# EAGLE design shirasu_v3 (EAGLE 9.6.2)
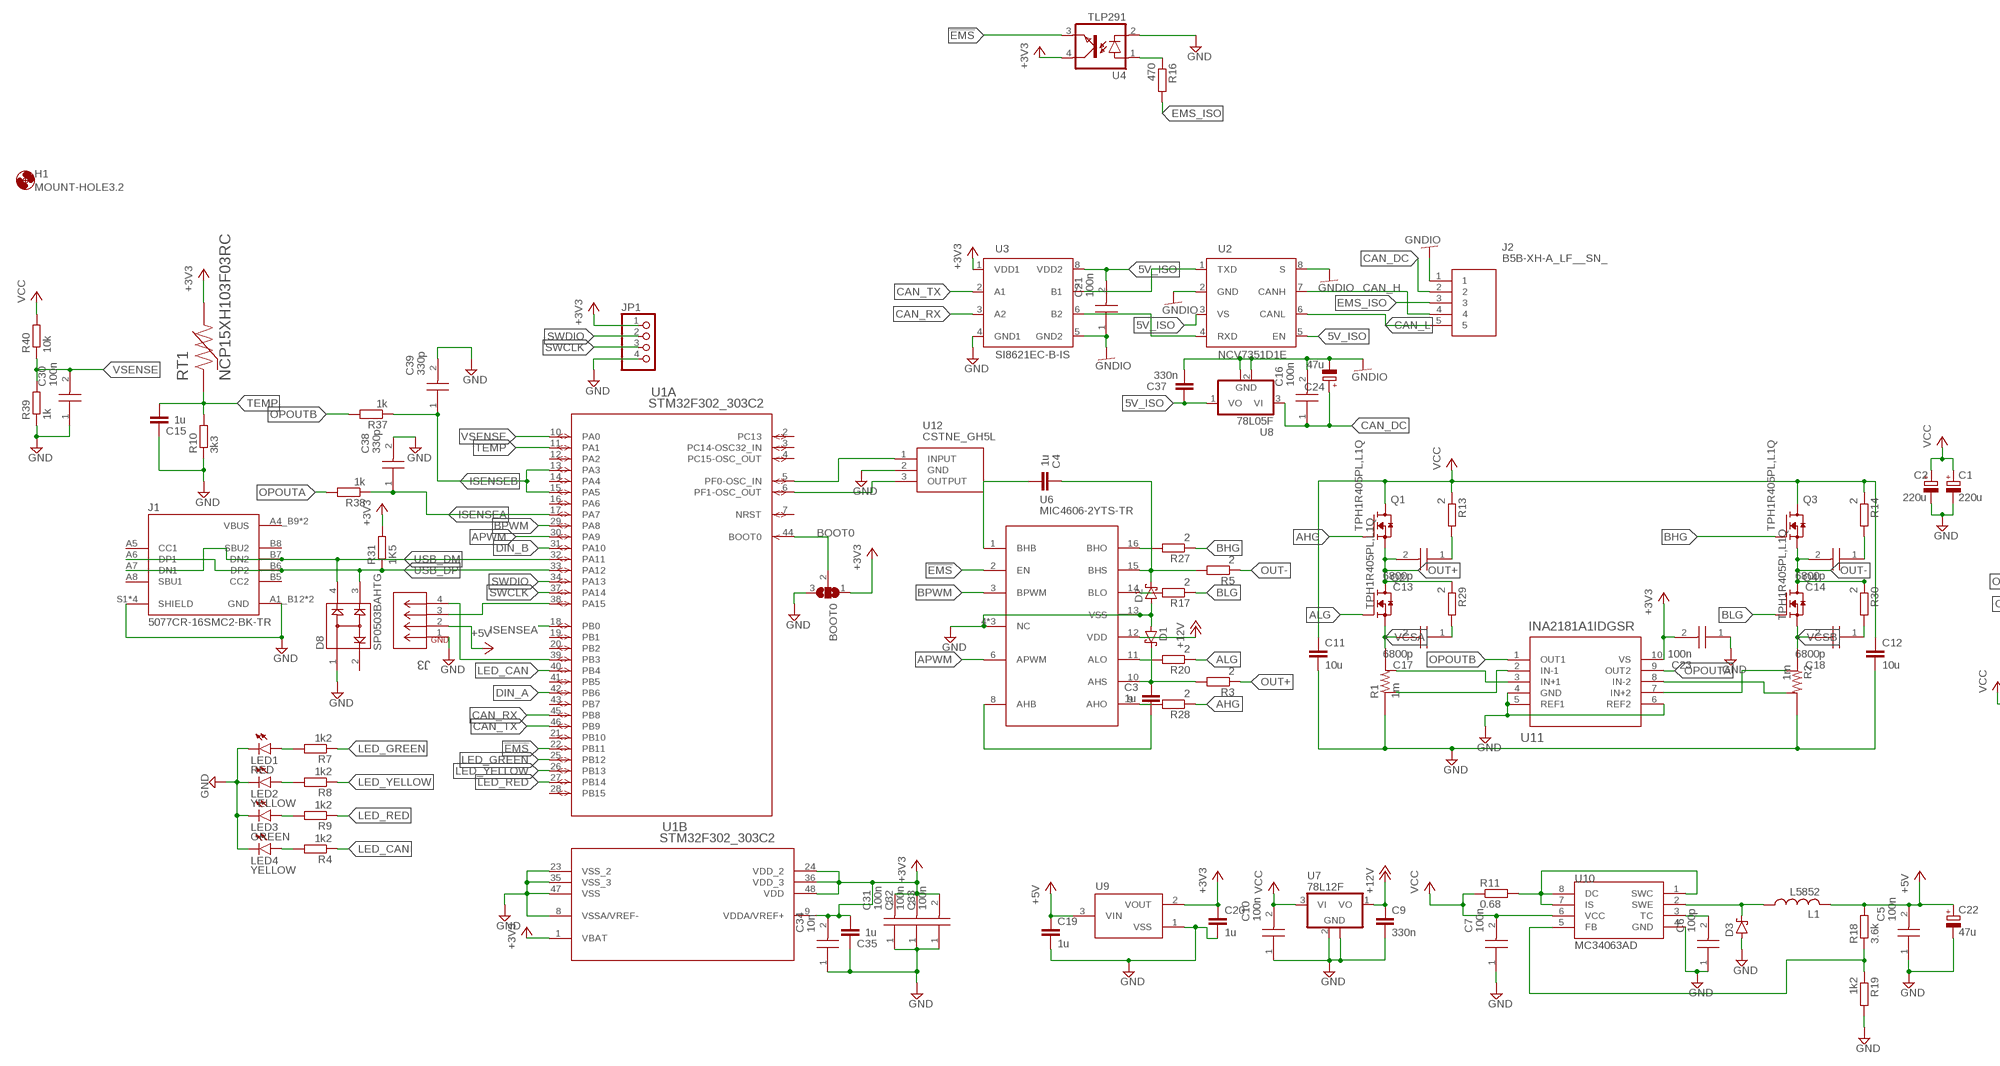
[diagram p0: schematic, sheet 1, part 1 of 2]
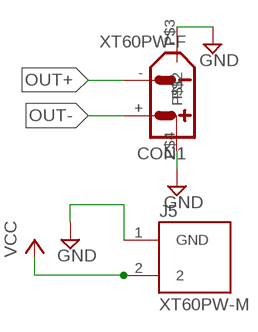
[diagram p1: schematic, sheet 1, part 2 of 2]

## Parts
BOOT0  SJ2W  [SJ_2]
C1  220u  CPOL-EUE5-10.5  [E5-10,5]
C2  220u  CPOL-EUE5-10.5  [E5-10,5]
C3  1u  C-EUC0603  [C0603]
C4  1u  C-EUC0603  [C0603]
C5  100n  0402B102K500NT  [CAPC1005X55N]
C6  100p  0402B102K500NT  [CAPC1005X55N]
C7  100n  0402B102K500NT  [CAPC1005X55N]
C9  330n  C-EUC0603  [C0603]
C10  100n  0402B102K500NT  [CAPC1005X55N]
C11  10u  C-EUC0805  [C0805]
C12  10u  C-EUC0805  [C0805]
C13  6800p  0402B102K500NT  [CAPC1005X55N]
C14  6800p  0402B102K500NT  [CAPC1005X55N]
C15  1u  C-EUC0603  [C0603]
C16  100n  0402B102K500NT  [CAPC1005X55N]
C17  6800p  0402B102K500NT  [CAPC1005X55N]
C18  6800p  0402B102K500NT  [CAPC1005X55N]
C19  1u  C-EUC0603  [C0603]
C20  1u  C-EUC0603  [C0603]
C21  100n  0402B102K500NT  [CAPC1005X55N]
C22  47u  CPOL-EUE2.5-5  [E2,5-5]
C23  100n  0402B102K500NT  [CAPC1005X55N]
C24  47u  CPOL-EUE2.5-5  [E2,5-5]
C30  100n  0402B102K500NT  [CAPC1005X55N]
C31  100n  0402B102K500NT  [CAPC1005X55N]
C32  100n  0402B102K500NT  [CAPC1005X55N]
C33  100n  0402B102K500NT  [CAPC1005X55N]
C34  10n  0402B102K500NT  [CAPC1005X55N]
C35  1u  C-EUC0603  [C0603]
C37  330n  C-EUC0603  [C0603]
C38  330p  0402B102K500NT  [CAPC1005X55N]
C39  330p  0402B102K500NT  [CAPC1005X55N]
CON1  XT60PW-F  [XT60PW-F]
D1  PMEG6010CEJ,115  [SOD323_ST]
D2  PMEG6010CEJ,115  [SOD323_ST]
D3  PMEG6010CEJ,115  [SOD323_ST]
D8  SP0503BAHTG  [SOT143]
H1  MOUNT-HOLE3.2  [3,2]
J1  5077CR-16SMC2-BK-TR  [NELTRON_5077CR-16SMC2-BK-TR]
J2  B5B-XH-A_LF__SN_  [SHDR5W64P0X250_1X5_1490X575X70]
J3  EP2.5-4-SIDE  [CONN4_1744426-4]
J5  XT60PW-M  [AMASS_XT60PW-M]
JP1  PINHD-1X4  [1X04]
L1  L5852  [L5852]
LED1  RED  LEDCHIP-LED0603  [CHIP-LED0603]
LED2  YELLOW  LEDCHIP-LED0603  [CHIP-LED0603]
LED3  GREEN  LEDCHIP-LED0603  [CHIP-LED0603]
LED4  YELLOW  LEDCHIP-LED0603  [CHIP-LED0603]
Q1  TPH1R405PL,L1Q  [SOPADVANCE]
Q2  TPH1R405PL,L1Q  [SOPADVANCE]
Q3  TPH1R405PL,L1Q  [SOPADVANCE]
Q4  TPH1R405PL,L1Q  [SOPADVANCE]
R1  1m  R2512  [2512-4PAD]
R2  1m  R2512  [2512-4PAD]
R3  2  R-EU_R0402  [R0402]
R4  1k2  R-EU_R0402  [R0402]
R5  2  R-EU_R0402  [R0402]
R7  1k2  R-EU_R0402  [R0402]
R8  1k2  R-EU_R0402  [R0402]
R9  1k2  R-EU_R0402  [R0402]
R10  3k3  R-EU_R0402  [R0402]
R11  0.68  R-EU_R1206  [R1206]
R13  2  R-EU_R0402  [R0402]
R14  2  R-EU_R0402  [R0402]
R16  470  R-EU_R0402  [R0402]
R17  2  R-EU_R0402  [R0402]
R18  3.6k  R-EU_R0603  [R0603]
R19  1k2  R-EU_R0402  [R0402]
R20  2  R-EU_R0402  [R0402]
R27  2  R-EU_R0402  [R0402]
R28  2  R-EU_R0402  [R0402]
R29  2  R-EU_R0402  [R0402]
R30  2  R-EU_R0402  [R0402]
R31  1K5  R-EU_R0402  [R0402]
R37  1k  R-EU_R0402  [R0402]
R38  1k  R-EU_R0402  [R0402]
R39  1k  R-EU_R0402  [R0402]
R40  10k  R-EU_R0402  [R0402]
RT1  NCP15XH103F03RC  [THRMC1005X55N]
U1  STM32F302_303C2  [LQFP48-7X7MM]
U2  NCV7351D1E  [SO08]
U3  SI8621EC-B-IS  [SO08]
U4  TLP291  [MINI-FLAT-4]
U6  MIC4606-2YTS-TR  [TSSOP16]
U7  78L12F  [SOT89]
U8  78L05F  [SOT89]
U9  XC6206  [SOT95P240X110-3]
U10  MC34063AD  [SOIC8]
U11  INA2181A1IDGSR  [DGS10]
U12  CSTNE_GH5L  [CSTNE_GH5L]

## Nets
5V_ISO: C21.2 C37.1 U2.3(VS) U2.5(EN) U3.8(VDD2) U8.1(VO)
!EMS: U1.22(A:PB11) U4.3(EMIT) U6.2(EN)
+3V3: BOOT0.1 C20.1 C23.2 C31.2 C32.2 C33.2 C34.2 C35.2 JP1.1 R31.2 RT1.2 U1.1(B:VBAT) U1.9(B:VDDA/VREF+) U1.24(B:VDD_2) U1.36(B:VDD_3) U1.48(B:VDD) U3.1(VDD1) U4.4(COL) U9.2(VOUT) U11.10(VS)
+5V: C5.2 C19.1 C22.+ J3.2 L1.P$2 R18.2 U9.3(VIN)
+12V: C9.1 U6.12(VDD) U7.1(VO)
AHG: Q1.4(G) R28.1
ALG: Q2.4(G) R20.1
APWM: U1.30(A:PA9) U6.6(APWM)
BHG: Q3.4(G) R27.1
BLG: Q4.4(G) R17.1
BOOT0: BOOT0.2 U1.44(A:BOOT0)
BPWM: U1.29(A:PA8) U6.3(BPWM)
CAN_DC: C16.1 C24.+ J2.2 U8.3(VI)
CAN_H: J2.4 U2.7(CANH)
CAN_L: J2.5 U2.6(CANL)
CAN_RX: U1.45(A:PB8) U3.3(A2)
CAN_TX: U1.46(A:PB9) U3.2(A1)
DIN_A: U1.42(A:PB6)
DIN_B: U1.31(A:PA10)
EMS_ISO: J2.3 R16.2
ENC_A: J3.3 U1.38(A:PA15)
ENC_B: J3.4 U1.39(A:PB3)
GND: BOOT0.3 C1.- C2.- C5.1 C6.1 C7.1 C9.2 C10.1 C11.2 C12.2 C15.1 C19.2 C20.2 C22.- C23.1 C30.1 C31.1 C32.1 C33.1 C34.1 C35.1 C38.2 C39.2 CON1.P$3 CON1.P$4 D1.A D2.A D3.A D8.1 J1.A1_B12(GND) J1.B1_A12(GND) J1.S1(SHIELD) J1.S2(SHIELD) J1.S3(SHIELD) J1.S4(SHIELD) J3.1 J5.1(GND) JP1.4 LED1.C LED2.C LED3.C LED4.C R1.1 R1.2 R2.3 R2.4 R10.1 R19.2 R39.1 U1.8(B:VSSA/VREF-) U1.23(B:VSS_2) U1.35(B:VSS_3) U1.47(B:VSS) U3.4(GND1) U4.2(C) U6.4(NC) U6.5(NC) U6.7(NC) U6.13(VSS) U7.2(GND) U7.2@1(GND) U9.1(VSS) U10.4(GND) U11.4(GND) U11.5(REF1) U11.6(REF2) U12.2(GND)
GNDIO: C16.2 C21.1 C24.- C37.2 J2.1 U2.2(GND) U2.8(S) U3.5(GND2) U8.2(GND) U8.2@1(GND)
ISENSEA: C38.1 R38.1 U1.17(A:PA7) U1.18(A:PB0)
ISENSEB: C39.1 R37.1 U1.13(A:PA3) U1.15(A:PA5)
LED_CAN: R4.1 U1.40(A:PB4)
LED_GREEN: R7.1 U1.25(A:PB12)
LED_RED: R9.1 U1.27(A:PB14)
LED_YELLOW: R8.1 U1.26(A:PB13)
N$1: C17.1 R29.2
N$2: C18.1 R30.2
N$3: R27.2 U6.16(BHO)
N$4: C4.1 D2.C R5.2 U6.15(BHS)
N$5: C4.2 U6.1(BHB)
N$6: R17.2 U6.14(BLO)
N$7: R20.2 U6.11(ALO)
N$8: R28.2 U6.9(AHO)
N$9: C3.2 U6.8(AHB)
N$10: C3.1 D1.C R3.2 U6.10(AHS)
N$11: LED1.A R7.2
N$12: LED2.A R8.2
N$13: LED3.A R9.2
N$14: LED4.A R4.2
N$15: U2.1(TXD) U3.7(B1)
N$16: U2.4(RXD) U3.6(B2)
N$18: C14.1 R14.2
N$19: U1.6(A:PF1-OSC_OUT) U12.3(OUTPUT)
N$20: C13.1 R13.2
N$22: R1.6 U11.3(IN+1)
N$23: R2.5 U11.7(IN+2)
N$25: R16.1 U4.1(A)
N$26: D3.C L1.P$1 U10.2(SWE)
N$27: C6.2 U10.3(TC)
N$28: R18.1 R19.1 U10.5(FB)
N$29: R2.6 U11.8(IN-2)
N$30: R11.2 U10.1(SWC) U10.7(IS) U10.8(DC)
N$31: R1.5 U11.2(IN-1)
N$34: U1.5(A:PF0-OSC_IN) U12.1(INPUT)
OPOUTA: R38.2 U11.9(OUT2)
OPOUTB: R37.2 U11.1(OUT1)
OUT+: C13.2 CON1.- Q1.1(S) Q1.2(S) Q1.3(S) Q2.5(D) Q2.6(D) Q2.7(D) Q2.8(D) Q2.9(D) R3.1 R29.1
OUT-: C14.2 CON1.+ Q3.1(S) Q3.2(S) Q3.3(S) Q4.5(D) Q4.6(D) Q4.7(D) Q4.8(D) Q4.9(D) R5.1 R30.1
SWCLK: JP1.3 U1.37(A:PA14)
SWDIO: JP1.2 U1.34(A:PA13)
TEMP: C15.2 R10.2 RT1.1 U1.11(A:PA1)
USB_DM: D8.4 J1.A7(DN1) J1.B7(DN2) U1.32(A:PA11)
USB_DP: D8.3 J1.A6(DP1) J1.B6(DP2) R31.1 U1.33(A:PA12)
VCC: C1.+ C2.+ C7.2 C10.2 C11.1 C12.1 J5.2 Q1.5(D) Q1.6(D) Q1.7(D) Q1.8(D) Q1.9(D) Q3.5(D) Q3.6(D) Q3.7(D) Q3.8(D) Q3.9(D) R11.1 R13.1 R14.1 R40.2 U7.3(VI) U10.6(VCC)
VCSA: C17.2 Q2.1(S) Q2.2(S) Q2.3(S) R1.3 R1.4
VCSB: C18.2 Q4.1(S) Q4.2(S) Q4.3(S) R2.1 R2.2
VSENSE: C30.2 R39.2 R40.1 U1.10(A:PA0)
Unconnected: D8.2 J1.A5(CC1) J1.A8(SBU1) J1.B5(CC2) J1.B8(SBU2) U1.2(A:PC13) U1.3(A:PC14-OSC32_IN) U1.4(A:PC15-OSC_OUT) U1.7(A:NRST) U1.12(A:PA2) U1.14(A:PA4) U1.16(A:PA6) U1.19(A:PB1) U1.20(A:PB2) U1.21(A:PB10) U1.28(A:PB15) U1.41(A:PB5) U1.43(A:PB7)

## Power pins joined to a net without a drawn wire
VBUS: J1.A4_B9(VBUS) J1.B4_A9(VBUS)

## Library data of the parts
BOOT0 = jumper:SJ2W: SMD solder JUMPER
C1 C2 C22 C24 = rcl:CPOL-EU: POLARIZED CAPACITOR, European symbol; SPICEPREFIX: C
C3 C4 C9 C11 C12 C15 C19 C20 C35 C37 = rcl:C-EU: CAPACITOR, European symbol; SPICEPREFIX: C
C5-C7 C10 C13 C14 C16-C18 C21 C23 C30-C34 C38 C39 = 0402B102K500NT:0402B102K500NT: Multilayer Ceramic Capacitors MLCC - SMD/SMT 1nF 50V 0402 RoHS Source: Datasheet <https://datasheet.lcsc.com/szlcsc/Guangdong-Fenghua-Advanced-Tech-0402B102K500NT_C1523.pdf>; DESCRIPTION: Multilayer Ceramic Capacitors MLCC - SMD/SMT 1nF 50V 0402 RoHS; HEIGHT: 0.55mm; MANUFACTURER_NAME: Guangdong Fenghua Advanced Tech; MANUFACTURER_PART_NUMBER: 0402B102K500NT
CON1 = amass:XT60: AMASS XT60 connector Store in Japan AMASS XT60 connector <https://szc.jp/ams-xt60>
D1-D3 = nexperia:PMEG6010CEJ,115: Schottky barrier diode
D8 = Littelfuse:SP0503BAHTG: TVS DIODE 5.5VWM 8.5VC SOT143; DESCRIPTION: 8.5V Clamp Ipp Tvs Diode Surface Mount SOT-143-4; DIGI-KEY_PART_NUMBER: F2715CT-ND; DIGI-KEY_PURCHASE_URL: https://www.digikey.com/product-detail/en/littelfuse-inc/SP0503BAHTG/F2715CT-ND/1154322?utm_source=snapeda&utm_medium=aggregator&utm_campaign=symbol; MF: Littelfuse Inc.; MP: SP0503BAHTG; PACKAGE: SOT-143 Littelfuse
H1 = holes:MOUNT-HOLE: MOUNTING HOLE with drill center marker
J1 = 5077CR-16SMC2-BK-TR:5077CR-16SMC2-BK-TR: Check availability <https://pricing.snapeda.com/parts/5077CR-16SMC2-BK-TR/Neltron/view-part?ref=eda>; AVAILABILITY: Not in stock; CHECK_PRICES: https://www.snapeda.com/parts/5077CR-16SMC2-BK-TR/Neltron/view-part/?ref=eda; DESCRIPTION: USB 3.1 C Type Female with Peg; MF: Neltron; MP: 5077CR-16SMC2-BK-TR; PACKAGE: Package; PRICE: None; SNAPEDA_LINK: https://www.snapeda.com/parts/5077CR-16SMC2-BK-TR/Neltron/view-part/?ref=snap
J2 = B5B-XH-A_LF__SN_:B5B-XH-A_LF__SN_: XH connector, 5 way Source: Datasheet <http://www.jst-mfg.com/product/pdf/eng/eXH.pdf>; ARROW_PART_NUMBER: B5B-XH-A(LF)(SN); ARROW_PRICE-STOCK: https://www.arrow.com/en/products/b5b-xh-a-lf-sn/jst-manufacturing; DESCRIPTION: XH connector, 5 way; HEIGHT: 7mm; MANUFACTURER_NAME: JST (JAPAN SOLDERLESS TERMINALS); MANUFACTURER_PART_NUMBER: B5B-XH-A(LF)(SN)
J3 = con-ep2.5:EP2.5-4-SIDE; MANUFACTURER_PART_NUMBER: 17444264; VENDOR: TE Connectivity
J5 = con-xt:XT60PW-M; AVAILABILITY: Unavailable; MF: AMASS; MP: XT60PW-M; PACKAGE: Package Analog Devices; PRICE: None
JP1 = pinhead:PINHD-1X4: PIN HEADER
L1 = inductors:L5852
LED1-LED4 = led:LED: LED OSRAM: - CHIPLED LG R971, LG N971, LY N971, LG Q971, LY Q971, LO R971, LY R971 LH N974, LH R974 LS Q976, LO Q976, LY Q976 LO Q996 - Hyper CHIPLED LW Q18S LB Q993, LB Q99A, LB R99A - SideLED LS A670, LO A670, LY A670, LG A670, LP A670 LB A673, LV A673, LT A673, LW A673 LH A674 LY A675 LS A676, LA A676, LO A676, LY A676, LW A676 LS A679, LY A679, LG A679 - Hyper Micro SIDELED® LS Y876, LA Y876, LO Y876, LY Y876 LT Y87S - SmartLED LW L88C, LW L88S LB L89C, LB L89S, LG L890 LS L89K, LO L89K, LY L89K LS L896, LA L896, LO L896, LY L896 - TOPLED LS T670, LO T670, LY T670, LG T670, LP T670 LSG T670, LSP T670, LSY T670, LOP T670, LYG T670 LG T671, LOG T671, LSG T671 LB T673, LV T673, LT T673, LW T673 LH T674 LS T676, LA T676, LO T676, LY T676, LB T676, LH T676, LSB T676, LW T676 LB T67C, LV T67C, LT T67C, LS T67K, LO T67K, LY T67K, LW E67C LS E67B, LA E67B, LO E67B, LY E67B, LB E67C, LV E67C, LT E67C LW T67C LS T679, LY T679, LG T679 LS T770, LO T770, LY T770, LG T770, LP T770 LB T773, LV T773, LT T773, LW T773 LH T774 LS E675, LA E675, LY E675, LS T675 LS T776, LA T776, LO T776, LY T776, LB T776 LHGB T686 LT T68C, LB T68C - Hyper Mini TOPLED® LB M676 - Mini TOPLED Santana® LG M470 LS M47K, LO M47K, LY M47K Source: http://www.osram.convergy.de LUXEON: - LUMILED® LXK2-PW12-R00, LXK2-PW12-S00, LXK2-PW14-U00, LXK2-PW14-V00 LXK2-PM12-R00, LXK2-PM12-S00, LXK2-PM14-U00 LXK2-PE12-Q00, LXK2-PE12-R00, LXK2-PE12-S00, LXK2-PE14-T00, LXK2-PE14-U00 LXK2-PB12-K00, LXK2-PB12-L00, LXK2-PB12-M00, LXK2-PB14-N00, LXK2-PB14-P00, LXK2-PB14-Q00 LXK2-PR12-L00, LXK2-PR12-M00, LXK2-PR14-Q00, LXK2-PR14-R00 LXK2-PD12-Q00, LXK2-PD12-R00, LXK2-PD12-S00 LXK2-PH12-R00, LXK2-PH12-S00 LXK2-PL12-P00, LXK2-PL12-Q00, LXK2-PL12-R00 Source: www.luxeon.com KINGBRIGHT: KA-3528ASYC Source: www.kingbright.com
Q1-Q4 = toshiba:TPH1R405PL,L1Q
R1 R2 = shunt-resistor:R2512
R3-R5 R7-R11 R13 R14 R16-R20 R27-R31 R37-R40 = rcl:R-EU_: RESISTOR, European symbol; SPICEPREFIX: R
RT1 = NCP15XH103F03RC:NCP15XH103F03RC: NTC Thermistor 10k 0402 (1005 Metric) Check prices <https://pricing.snapeda.com/parts/NCP15XH103F03RC/Murata/view-part?ref=eda>; AVAILABILITY: Good; DESCRIPTION: NTC Thermistor 10k 0402 (1005 Metric); MF: Murata; MP: NCP15XH103F03RC; PACKAGE: 1005 Taiyo Yuden; PRICE: None; PURCHASE-URL: https://pricing.snapeda.com/search/part/NCP15XH103F03RC/?ref=eda
U1 = stm32_mcu:STM32F302_303C2; COPYRIGHT: Copyright (C) 2016 Accelerated Designs. All rights reserved; MANUFACTURER_PART_NUMBER: STM32F302_303C2; VENDOR: STMicroelectronics
U2 = on-semi:NCV7351D1E: High Speed CAN Transceiver Source: NCV7351-D.PDF <http://www.onsemi.com/PowerSolutions/document/NCV7351-D.PDF>
U3 = silicon-labs:SI8621EC-B-IS: 1 Mbps Digital Isolator 1 Mbps, 2.5 kVRMS Digital Isolator Source: Si86xx.pdf <https://www.silabs.com/documents/public/data-sheets/Si86xx.pdf>
U4 = toshiba:TLP291: TOSHIBA PHOTOCOUPLER GaAs IRED & PHOTO-TRANSISTOR; OC_FARNELL: unknown; OC_NEWARK: unknown
U6 = Microchip:MIC4606-2YTS-TR
U7 U8 = linear:78L*: POSITOIV-VOLTAGE REGULATORS Output up to 100 mA Source: Datasheet <http://focus.ti.com/lit/ds/symlink/ua78l05.pdf>
U9 = torex:XC6206
U10 = mc34063:MC34063
U11 = texas-instruments:INA2181A1IDGSR; BUILT_BY: EMA_Jessica; COPYRIGHT: Copyright (C) 2018 Accelerated Designs. All rights reserved; MANUFACTURER_PART_NUMBER: INA2181A1IDGSR; VENDOR: Texas Instruments
U12 = resonator:CSTNE_GH5L: Resonators 8.0000MHz 33pF SMD CHP Resntr Tol 0.07% Source: Datasheet <https://componentsearchengine.com/Datasheets/1/CSTNE8M00GH5L000R0.pdf>; DESCRIPTION: Resonators 8.0000MHz 33pF SMD CHP Resntr Tol 0.07%; HEIGHT: 1mm; MANUFACTURER_NAME: Murata Electronics; MANUFACTURER_PART_NUMBER: CSTNE8M00GH5L000R0; MOUSER_PART_NUMBER: 81-CSTNE8M00GH5L000R; MOUSER_PRICE-STOCK: https://www.mouser.com/Search/Refine.aspx?Keyword=81-CSTNE8M00GH5L000R

## Board
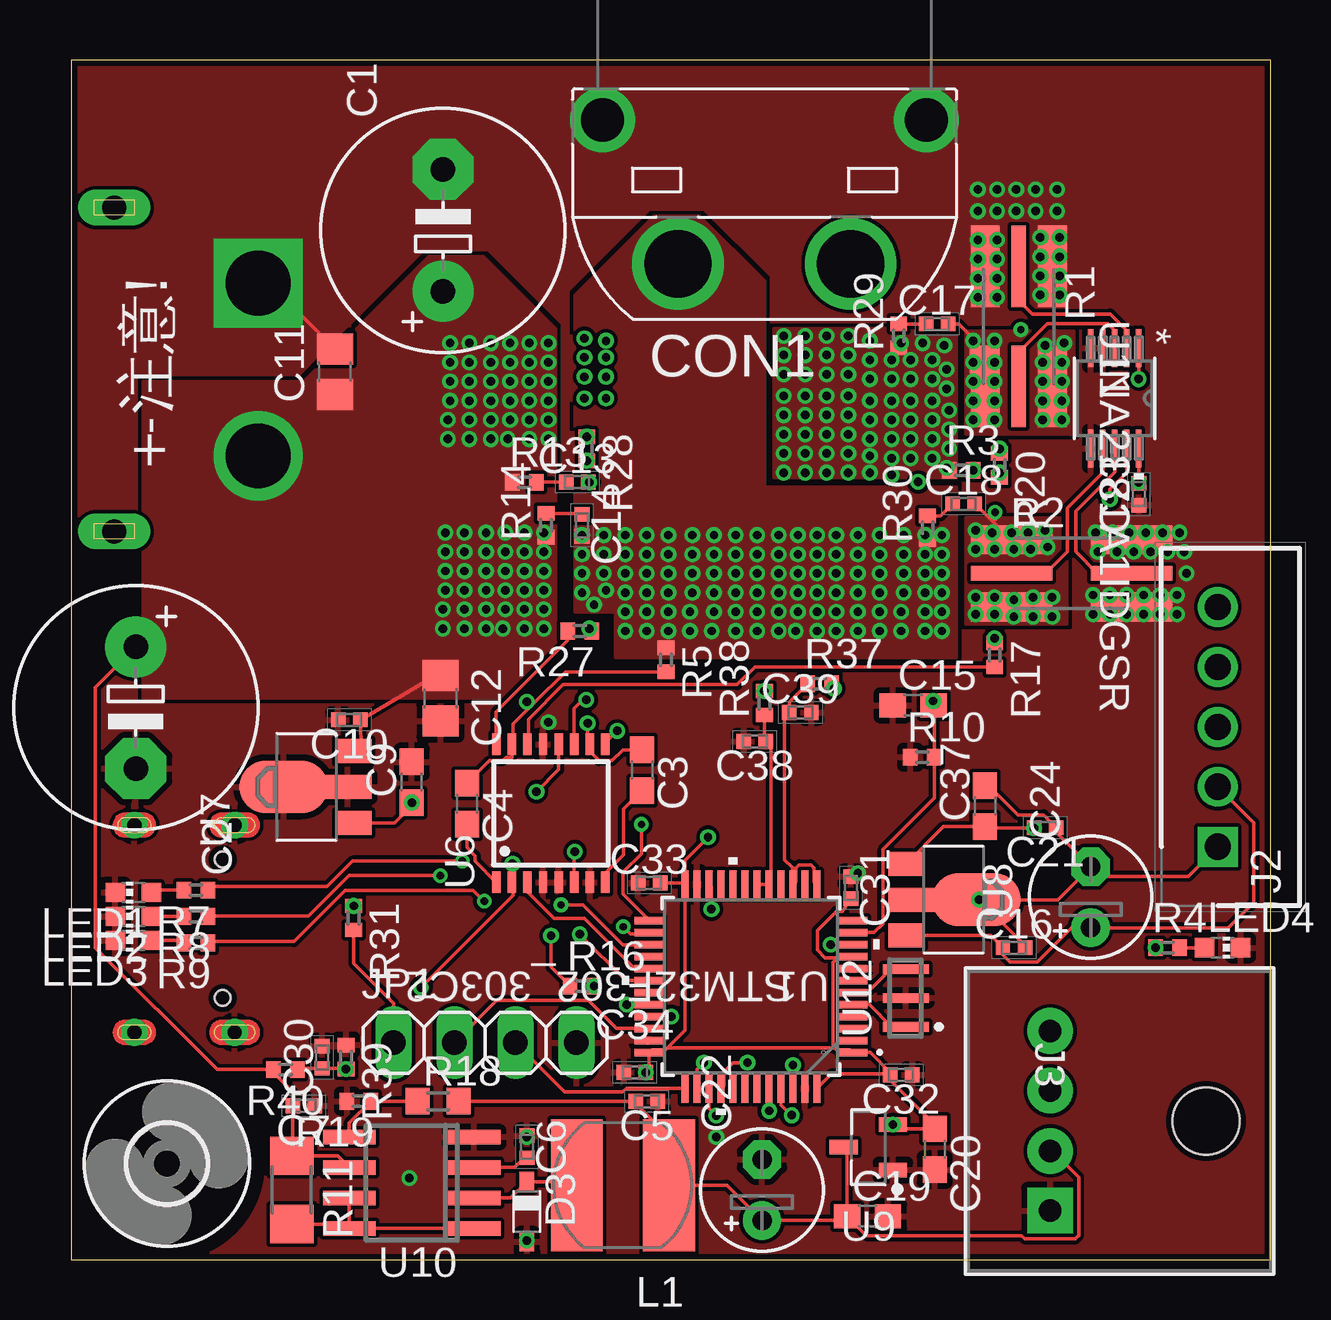
[diagram p2: board, top side]
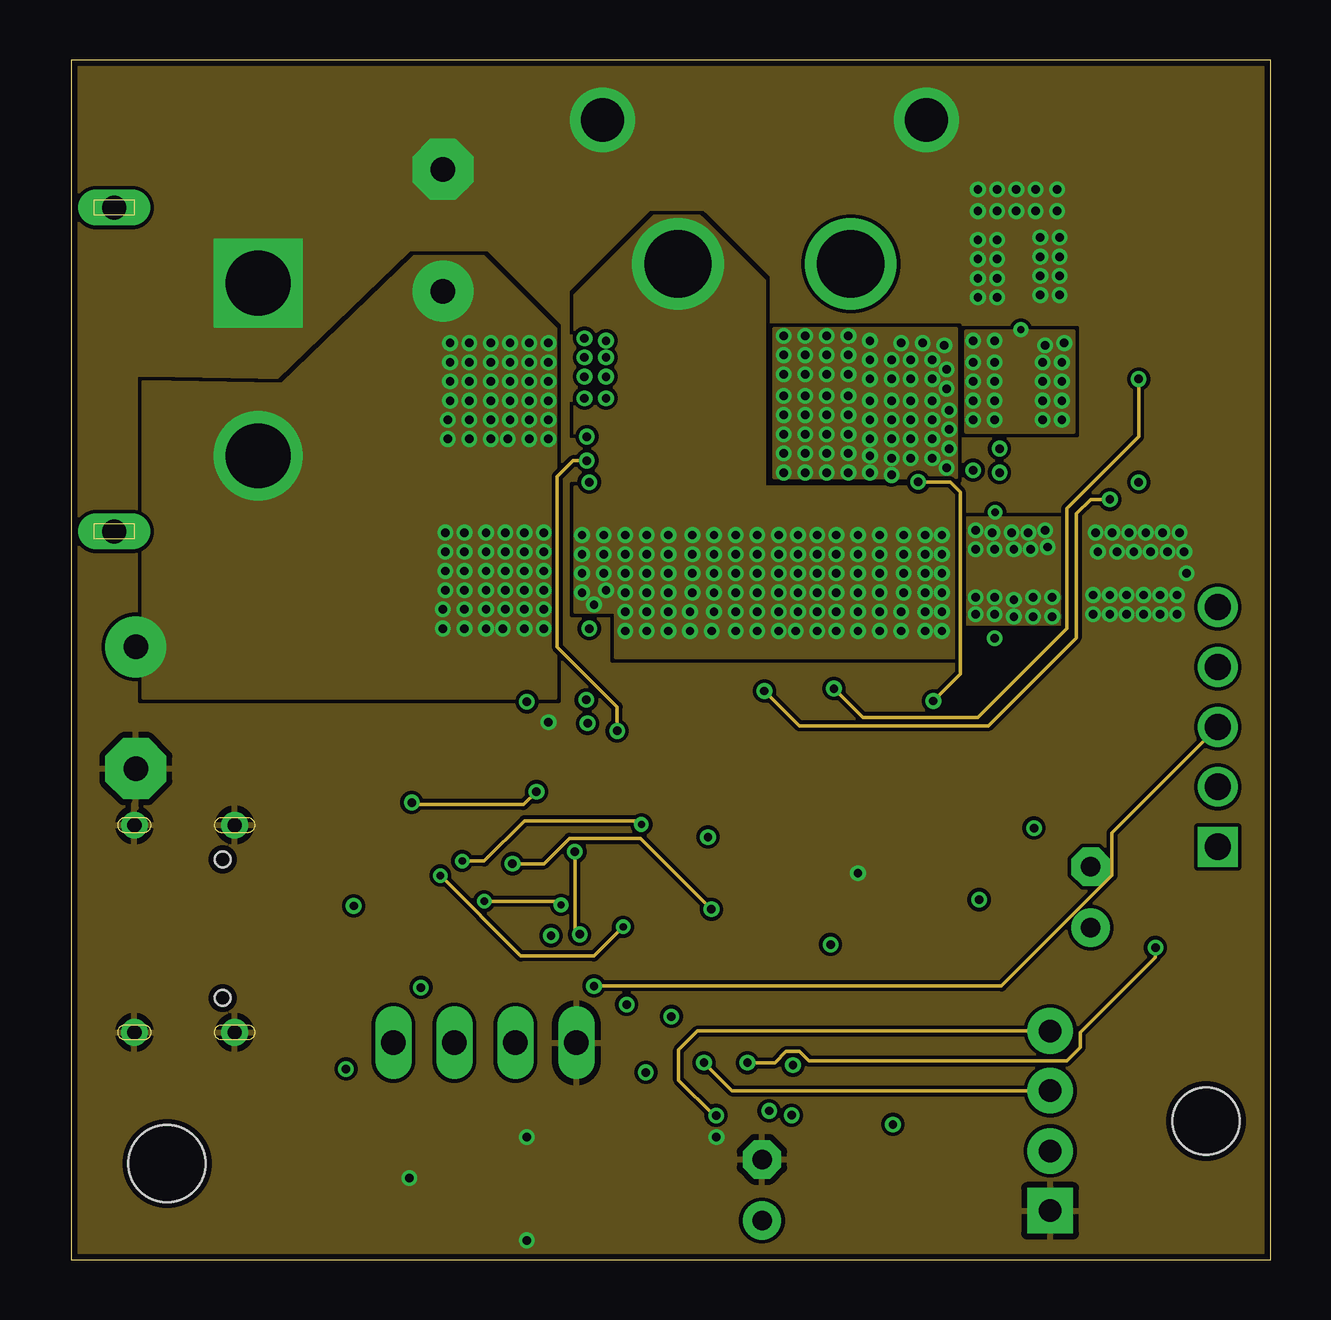
[diagram p3: board, inner layer Route2]
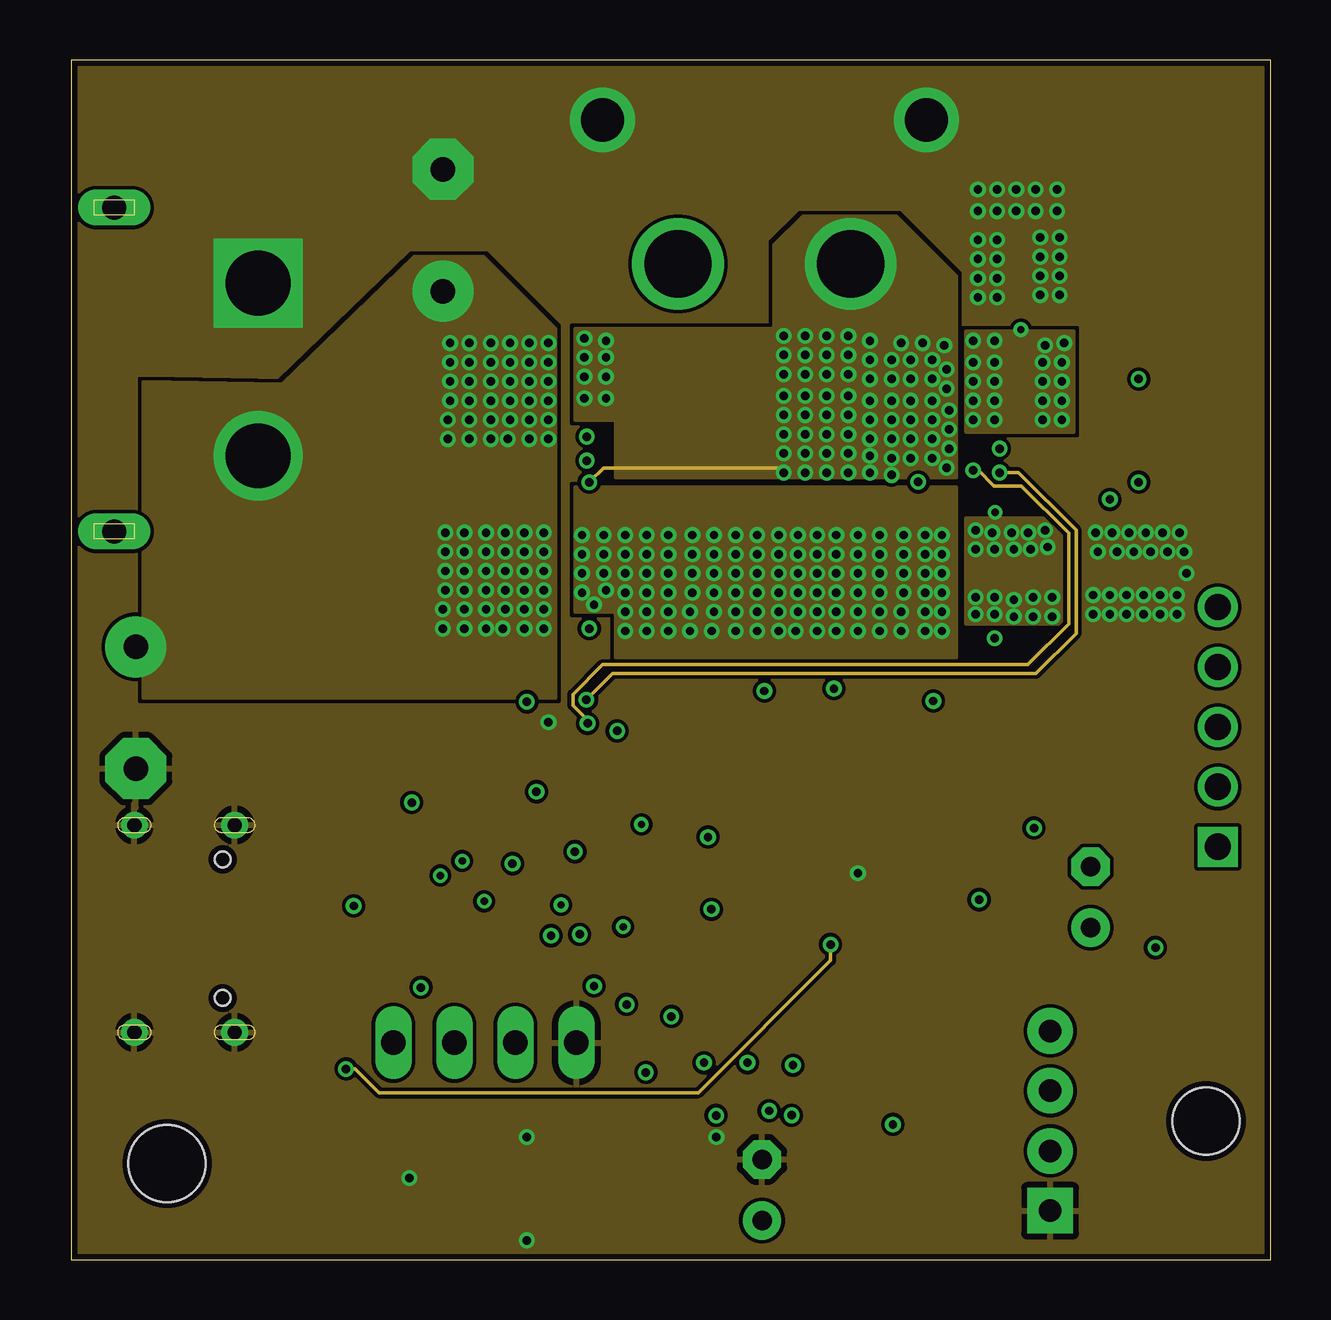
[diagram p4: board, inner layer Route15]
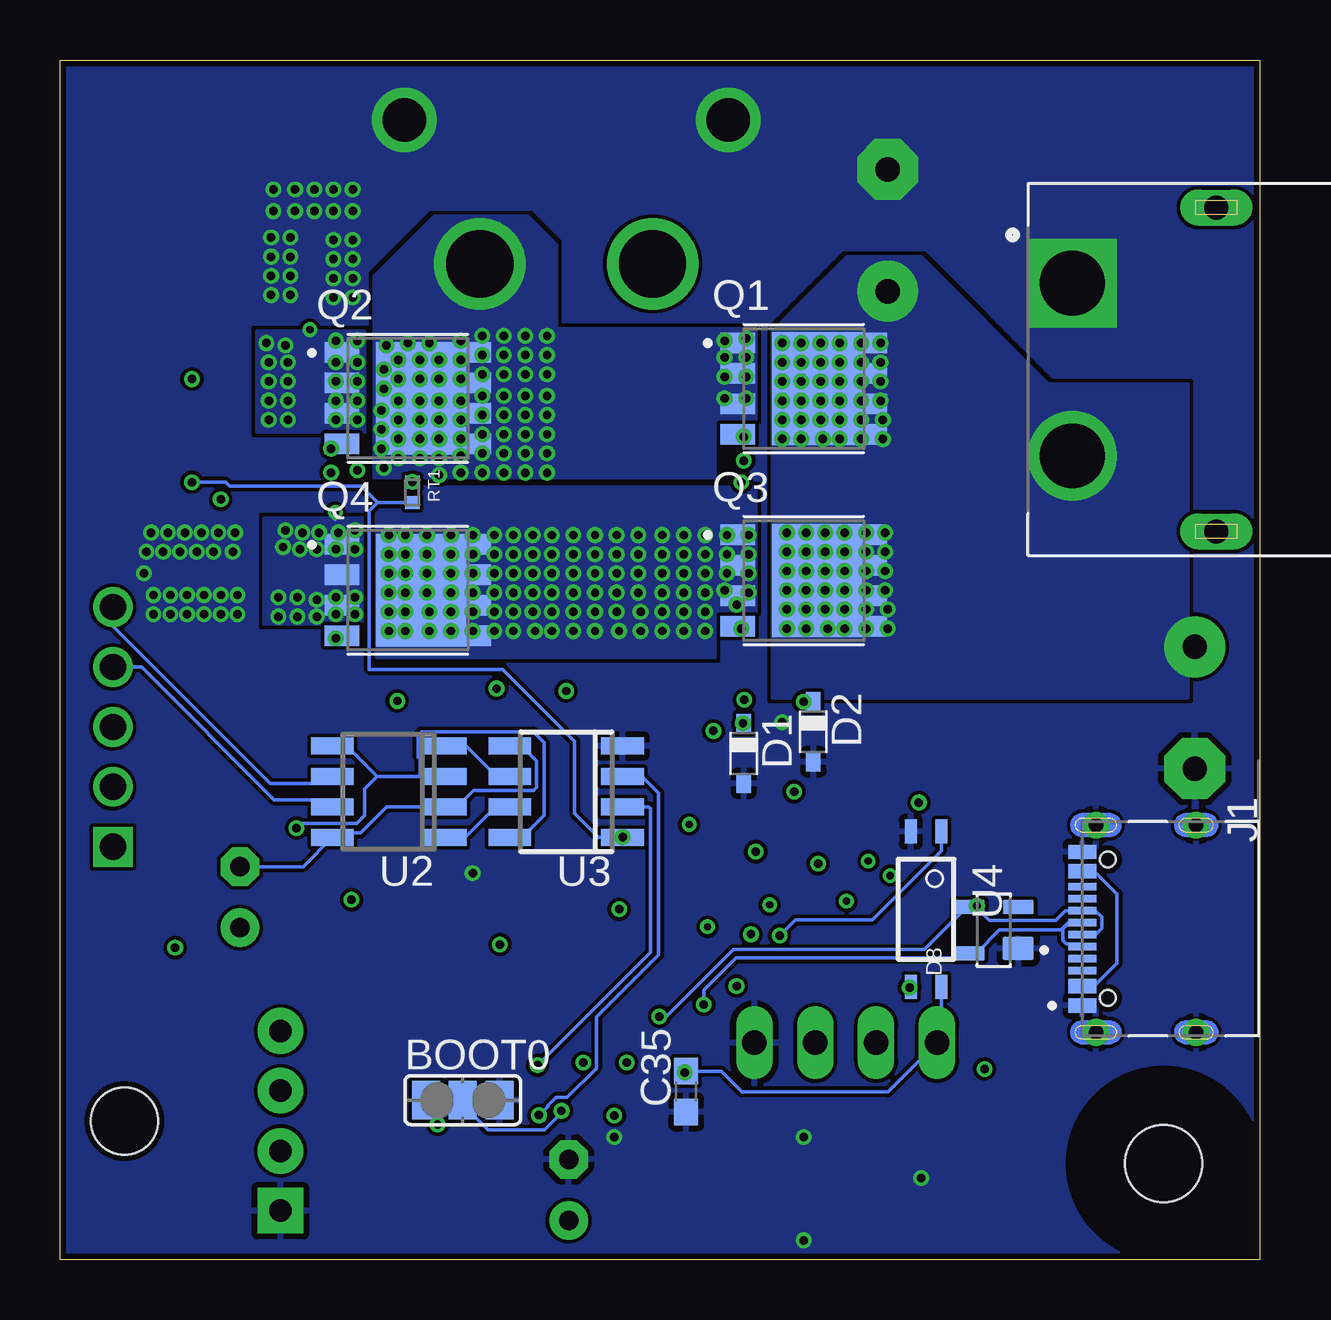
[diagram p5: board, bottom side, seen from below]

Size 50 x 50 mm. Coordinates in mm from the lower left corner, seen from the top.
Outline: 0,0 50,0 50,50 0,50 0,0
Copper layers (1+2*15+16): Top 0.035mm / dielectric 1.5mm / Route2 0.0175mm / dielectric 1.1mm / Route15 0.0175mm / dielectric 0.2mm / Bottom 0.035mm
Design rules "SeeedStudio_2layer_DRU_no_angle_20140221 *": minimum track width 6mil, minimum drill 12mil, track to track 6mil, track to pad 6mil, pad to pad 6mil, via to via 6mil, smd to smd 0mil, copper to edge 10mil, drill to drill 10mil, minimum pad ring 10mil, minimum via ring 6mil, stop-mask expansion 2mil, vias tented up to drill 100mil, thermal gap 10mil

### Footprints (pad centres in the part's own frame; a part is rotated, then mirrored left to right if it is on the bottom)
SJ_2 = smd 1.168 x 1.6: 1 -1.524,0; 2 0,0; 3 1.524,0
E5-10,5 = drill 1.016 pad 2.54: + -2.54,0 | drill 1.016 pad 2.54 octagon: - 2.54,0
C0603 = smd 1.1 x 1: 1 -0.85,0; 2 0.85,0
CAPC1005X55N = smd 0.6 x 0.62: 1 -0.46,0; 2 0.46,0
C0805 = smd 1.3 x 1.5: 1 -0.95,0; 2 0.95,0
E2,5-5 = drill 0.813 pad 1.6: + -1.27,0 | drill 0.813 pad 1.6 octagon: - 1.27,0
XT60PW-F = drill 2.8: + -3.6,0; - 3.6,0 | drill 1.8: P$3 -6.75,6; P$4 6.75,6
SOD323_ST = smd 0.8 x 0.6: A 1.25,0; C -1.25,0
SOT143 = smd 0.99 x 1.3: 1 -0.76,-1.025 | smd 0.59 x 1.3: 2 0.96,-1.025; 3 0.96,1.025; 4 -0.96,1.025
3,2 = hole 3.2: 0,0
NELTRON_5077CR-16SMC2-BK-TR = smd 0.6 x 1.15: A1_B12 -3.2,1.065; A4_B9 -2.4,1.065; B1_A12 3.2,1.065; B4_A9 2.4,1.065 | smd 0.3 x 1.15: A5 -1.25,1.065; A6 -0.25,1.065; A7 0.25,1.065; A8 1.25,1.065; B5 1.75,1.065; B6 0.75,1.065; B7 -0.75,1.065; B8 -1.75,1.065 | drill 0.6 pad 1: S1 -4.32,-3.68; S2 4.32,-3.68; S3 -4.32,0.5; S4 4.32,0.5 | hole 0.65: -2.89,0; 2.89,0
SHDR5W64P0X250_1X5_1490X575X70 = drill 1.1 pad 1.65 square: 1 0,0 | drill 1.1 pad 1.65: 2 -2.5,0; 3 -5,0; 4 -7.5,0; 5 -10,0
CONN4_1744426-4 = drill 0.94 pad 1.905 square: 1 7.493,0 | drill 0.94 pad 1.905: 2 5.004,0; 3 2.489,0; 4 0,0 | hole 2.794: 3.759,6.502
AMASS_XT60PW-M = drill 2.7 square: 1 -3.6,-6 | drill 2.7: 2 3.6,-6 | drill 1 pad 1.2 long: S1 -6.75,0; S2 6.75,0
1X04 = drill 1.016 long: 1 -3.81,0; 2 -1.27,0; 3 1.27,0; 4 3.81,0
L5852 = smd 2.15 x 5.5: P$1 1.925,0; P$2 -1.925,0
CHIP-LED0603 = smd 0.8 x 0.8: A 0,-0.75; C 0,0.75
SOPADVANCE = smd 1.45 x 0.85: 1 -2.75,1.905; 2 -2.75,0.635; 3 -2.75,-0.635; 4 -2.75,-1.905 | smd 1.05 x 0.85: 5 2.95,-1.905; 6 2.95,-0.635; 7 2.95,0.635; 8 2.95,1.905 | smd 3.75 x 4.7: 9 0.55,0
2512-4PAD = smd 3.4 x 1.2: 1 -2.5,1.4; 2 -2.5,-1.4; 3 2.5,1.4; 4 2.5,-1.4 | smd 3.4 x 0.6: 5 -2.5,0; 6 2.5,0
R0402 = smd 0.6 x 0.7: 1 -0.5,0; 2 0.5,0
R1206 = smd 1.6 x 1.803: 1 -1.422,0; 2 1.422,0
R0603 = smd 1 x 1.1: 1 -0.85,0; 2 0.85,0
THRMC1005X55N = smd 0.54 x 0.6: 1 -0.432,0; 2 0.432,0
LQFP48-7X7MM = smd 1.194 x 0.305: 1 -4.25,2.75; 2 -4.25,2.25; 3 -4.25,1.75; 4 -4.25,1.25; 5 -4.25,0.75; 6 -4.25,0.25; 7 -4.25,-0.25; 8 -4.25,-0.75; 9 -4.25,-1.25; 10 -4.25,-1.75; 11 -4.25,-2.25; 12 -4.25,-2.75; 25 4.25,-2.75; 26 4.25,-2.25; 27 4.25,-1.75; 28 4.25,-1.25; 29 4.25,-0.75; 30 4.25,-0.25; 31 4.25,0.25; 32 4.25,0.75; 33 4.25,1.25; 34 4.25,1.75; 35 4.25,2.25; 36 4.25,2.75 | smd 0.305 x 1.194: 13 -2.75,-4.25; 14 -2.25,-4.25; 15 -1.75,-4.25; 16 -1.25,-4.25; 17 -0.75,-4.25; 18 -0.25,-4.25; 19 0.25,-4.25; 20 0.75,-4.25; 21 1.25,-4.25; 22 1.75,-4.25; 23 2.25,-4.25; 24 2.75,-4.25; 37 2.75,4.25; 38 2.25,4.25; 39 1.75,4.25; 40 1.25,4.25; 41 0.75,4.25; 42 0.25,4.25; 43 -0.25,4.25; 44 -0.75,4.25; 45 -1.25,4.25; 46 -1.75,4.25; 47 -2.25,4.25; 48 -2.75,4.25
SO08 = smd 0.72 x 1.78: 1 -1.905,-2.35; 2 -0.635,-2.35; 3 0.635,-2.35; 4 1.905,-2.35; 5 1.905,2.35; 6 0.635,2.35; 7 -0.635,2.35; 8 -1.905,2.35
MINI-FLAT-4 = smd 1 x 0.5: 1 -3.24,0.635; 2 -3.24,-0.635; 3 3.24,-0.635; 4 3.24,0.635
TSSOP16 = smd 0.9 x 0.35: 1 -2.875,2.275; 2 -2.875,1.625; 3 -2.875,0.975; 4 -2.875,0.325; 5 -2.875,-0.325; 6 -2.875,-0.975; 7 -2.875,-1.625; 8 -2.875,-2.275; 9 2.875,-2.275; 10 2.875,-1.625; 11 2.875,-0.975; 12 2.875,-0.325; 13 2.875,0.325; 14 2.875,0.975; 15 2.875,1.625; 16 2.875,2.275
SOT89 = smd 1 x 1.5: 1 -1.499,-1.981; 3 1.499,-1.981 | smd 1 x 2: 2 0,-1.727 | smd 2.2 x 3.7: 2@1 0,0.94
SOT95P240X110-3 = smd 1.18 x 0.609: 1 -1.024,0.95; 2 -1.024,-0.95; 3 1.024,0
SOIC8 = smd 0.6 x 2.2: 1 -1.905,-2.6; 2 -0.635,-2.6; 3 0.635,-2.6; 4 1.905,-2.6; 5 1.905,2.6; 6 0.635,2.6; 7 -0.635,2.6; 8 -1.905,2.6
DGS10 = smd 1.575 x 0.229: 1 -2.095,1; 2 -2.095,0.5; 3 -2.095,0; 4 -2.095,-0.5; 5 -2.095,-1; 6 2.095,-1; 7 2.095,-0.5; 8 2.095,0; 9 2.095,0.5; 10 2.095,1
CSTNE_GH5L = smd 0.4 x 1.9: 1 -1.2,0; 2 0,0; 3 1.2,0

### Placement (x,y rotation side)
BOOT0  33.21,6.64 0 bottom
C1  15.5,42.9 90 top
C2  2.7,23 270 top
C3  23.8,20.4 270 top
C4  16.5,19 270 top
C5  24,6.6 180 top
C6  19,4.7 270 top
C7  9.7,6.4 180 top
C9  14.2,19.9 90 top
C10  11.6,22.5 0 top
C11  11,37 90 top
C12  15.4,23.4 270 top
C13  21.1,32.4 0 top
C14  21.3,30.6 270 top
C15  35.1,23.1 0 top
C16  39.3,13 0 top
C17  36.1,39 0 top
C18  37.2,31.5 0 top
C19  33.2,1.8 0 top
C20  36,4.6 270 top
C21  40.6,18 180 top
C22  28.8,2.9 90 top
C23  44.5,31.9 90 top
C24  42.5,15.1 90 top
C30  10.47,8.43 270 top
C31  32.5,15.5 270 top
C32  34.6,7.7 180 top
C33  24.1,15.7 0 top
C34  23.5,7.8 0 top
C35  23.9,7 90 bottom
C37  38.1,18.9 90 top
C38  28.5,21.6 180 top
C39  30.4,22.8 0 top
CON1  28.9,41.5 0 top
D1  21.5,21.1 270 bottom
D2  18.6,22 270 bottom
D3  19,2 270 top
D8  11.08,13.73 90 bottom
H1  4,4 0 top
J1  6.32,13.79 90 bottom
J2  47.8,17.2 270 top
J3  40.81,9.53 270 top
J5  1.8,37.1 270 bottom
JP1  17.25,9.04 0 top
L1  23,3.1 180 top
LED1  2.6,15.3 90 top
LED2  2.6,14.3 90 top
LED3  2.6,13.3 90 top
LED4  48,13 270 top
Q1  19,36.3 0 bottom
Q2  35.5,35.9 0 bottom
Q3  19,28.3 0 bottom
Q4  35.5,27.9 0 bottom
R1  39.5,38.9 270 top
R2  41.7,28.6 0 top
R3  37.1,32.9 0 top
R4  45.7,13 0 top
R5  24.8,25 270 top
R7  5.2,15.4 180 top
R8  5.2,14.3 180 top
R9  5.2,13.2 180 top
R10  35.48,20.94 0 top
R11  9.2,2.9 270 top
R13  18.9,32.4 0 top
R14  19.8,30.6 90 top
R16  21.3,11.4 0 top
R17  38.5,25.2 270 top
R18  15.3,6.6 0 top
R19  12,6.6 180 top
R20  38.7,33.1 270 top
R27  21.2,26.2 180 top
R28  21.5,33.8 270 top
R29  34.5,38.5 90 top
R30  35.7,30.5 90 top
R31  11.78,14.24 270 top
R37  31.2,24 0 top
R38  28.9,23.2 90 top
R39  11.46,8.44 270 top
R40  8.94,7.92 180 top
RT1  35.31,31.98 270 bottom
U1  28.34,11.38 180 top
U2  36.3,19.5 90 bottom
U3  28.9,19.5 90 bottom
U4  13.9,14.6 270 bottom
U6  20,18.6 90 top
U7  9.8,19.7 90 top
U8  36.8,15 270 top
U9  33.23,4.68 180 top
U10  14.2,3.2 90 top
U11  43.5,35.9 270 top
U12  34.8,10.9 90 top

### Tracks (layer width: path | path; a pad name or v marks a point on that pad's centre or on a via)
5V_ISO  (via drill 0.35)
  Top 0.152: U8.1 36.37,18.05 C37.1 38.15,18 C21.2 v40.14,17.98
  Bottom 0.152: 36.78,20.14 35,20.14 | 35,20.14 U2.3 | U2.5 38.05,21.41 36.78,20.14 | v40.14,17.98 39.94,18.18 37.63,18.18 37.31,18.51 37.31,19.61 36.78,20.14 | U3.8 30.75,17.59 29.83,18.52 29.83,21.55 30.27,21.99 34.94,21.99 35.07,21.86 35.07,20.95 35,20.88 35,20.14
!EMS  (via drill 0.35)
  Top 0.152: v14.58,11.34 18.43,15.18 18.43,15.67 U6.2 18.38,16.48 v18.4,16.5 | U1.22 26.69,15.53 v26.69,14.6
  Route2 0.152: v18.4,16.5 19.71,16.5 20.77,17.56 23.74,17.56 v26.69,14.6
  Bottom 0.152: v14.58,11.34 14.56,11.36 U4.3
+3V3  (via drill 0.35)
  Top 0.152: 34.14,7.48 36,5.62 C20.1 34.43,5.45 v34.26,5.63 | 34.14,7.48 33.89,7.73 31.69,7.73 U1.48 | v26.55,17.61 U3.1 25.59,16.63 U1.24 | C34.2 24.09,7.93 U1.36 24.21,8.75 24.78,8.75 24.86,8.82 | R31.2 11.78,12.35 13.44,10.69 JP1.1 | C23.2 v44.5,32.4 U11.10 | C33.2 25.52,15.7 U1.24 | 24.86,8.82 25.59,9.56 U1.24 | 31.82,8.82 31.9,8.75 32.47,8.75 U1.1 33.31,8.63 34.14,7.8 C32.2 34.14,7.48 | 31.82,8.82 31.77,8.88 31.77,12.38 32,12.61 32.57,12.61 U1.9 31.95,12.63 31.89,12.57 31.43,12.57 31.11,12.9 31.11,13.72 31.9,14.51 32.15,14.51 C31.2 | 31.82,8.82 24.86,8.82
  Bottom 0.152: RT1.2 36.75,31.55 36.76,31.56 | v44.5,32.4 43.09,32.4 42.93,32.24 37.44,32.24 36.76,31.56 | C34.2 C35.2 22.43,7.85 21.57,6.99 15.49,6.99 JP1.1 13.27,9.21 U4.4 | v34.26,5.63 34.26,6.17 BOOT0.1 | v26.55,17.61 U3.1 27.55,17.59 28.55,18.59 28.55,21.59 31.55,24.59 37.11,24.59 37.11,31.2 36.76,31.56
  other vias: 23.96,7.8
+5V
  Top 0.152: C19.1 32.18,1.63 C22.+ 27.33,3.1 L1.P$2 24.93,5.1 23.54,6.49 C5.2 R18.2 | U9.3 32.35,4.54 C19.1 | C19.1 33.15,1 39.62,1 39.76,0.86 41.86,0.86 41.99,0.99 42,1 42,3.44 40.91,4.53 J3.2
+12V  (via drill 0.35)
  Top 0.152: U6.12 20.32,20.43 v19.4,19.5 | U7.1 13.48,18.2 14.2,18.92 C9.1
  Route2 0.152: v19.4,19.5 18.86,18.96 14.29,18.96 C9.1
  other vias: 14.2,19.05
AHG  (via drill 0.35)
  Bottom 0.152: R28.1 21.55,34.28 21.7,34.28 Q1.4
  other vias: 21.5,34.3
ALG  (via drill 0.35)
  Top 0.152: v38.7,33.8 38.83,33.73 R20.1
  Bottom 0.152: v38.7,33.8 38.67,33.88 38.37,33.88 Q2.4
APWM  (via drill 0.35)
  Top 0.152: v21.2,13.55 23.12,11.63 U1.30 | v21,17 20.98,16.98 U6.6
  Route2 0.152: v21.2,13.55 21,13.76 v21,17
BHG  (via drill 0.35)
  Top 0.152: R27.1 v21.6,26.3
  Bottom 0.152: Q3.4 21.66,26.3 v21.6,26.3
BLG  (via drill 0.35)
  Top 0.152: R17.1 38.3,25.9 v38.5,25.9
  Bottom 0.152: v38.5,25.9 38.51,25.75 Q4.4
BOOT0  (via drill 0.35)
  Top 0.152: v29.1,6.2 U1.44
  Bottom 0.152: BOOT0.2 33.21,6.46 32.16,5.41 29.8,5.41 29.1,6.11 v29.1,6.2
BPWM
  Top 0.152: U1.29 23.49,12.13 21.41,14.21 20.14,14.21 19.02,15.33 U6.3
CAN_DC
  Top 0.152: U8.3 38.34,13.5 C16.1 38.84,12.7 39.14,12.4 40.27,12.4 41.7,13.83 C24.+ 48.23,13.83 49.3,14.9 49.3,18.2 J2.2
CAN_H
  Bottom 0.152: U2.7 38.95,19.16 41.06,19.16 46.6,24.7 J2.4
CAN_L
  Bottom 0.152: U2.6 38.95,19.84 41.23,19.84 47.8,26.4 J2.5
CAN_RX  (via drill 0.35)
  Top 0.152: v30.03,6.01 29.59,6.46 U1.45
  Bottom 0.152: U3.3 25.73,20.14 25.05,19.45 25.05,12.7 27.64,10.11 27.64,7.98 28.86,6.75 29.33,6.75 29.65,6.43 29.65,6.4 v30.03,6.01
CAN_TX  (via drill 0.35)
  Top 0.152: U1.46 v30.09,8.1
  Bottom 0.152: v30.09,8.1 25.39,12.8 25.39,18.8 25.46,18.86 U3.2
EMS_ISO  (via drill 0.35)
  Route2 0.152: J2.3 43.39,17.79 43.39,16 38.79,11.4 R16.2
  other vias: 21.8,11.4
ENC_A  (via drill 0.35)
  Top 0.152: U1.38 26.09,7.92 v26.38,8.21
  Route2 0.152: v26.38,8.21 27.55,7.04 J3.3
ENC_B  (via drill 0.35)
  Top 0.152: U1.39 26.59,6.3 v26.89,6
  Route2 0.152: v26.89,6 26.8,6 25.32,7.48 25.32,8.74 26.12,9.53 J3.4
GND  (via drill 0.35)
  Top 0.152: C11.2 8.44,40.51 7.9,40.7 J5.1
  other vias: 32.8,16.1 26.9,5.1 19.9,22.4 19,5.1 19,0.8 14.1,3.4 42.7,30.3 42.8,29.5 43.4,30.3 43.6,29.5 44.1,30.3 44.3,29.5 44.8,30.3 45,29.5 42.6,27.7 42.6,26.9 43.3,27.7 43.3,26.9 44,27.7 44,26.9 44.7,27.7 44.7,26.9 37.8,40.1 38.6,40.1 37.8,40.9 38.6,40.9 37.8,41.7 38.6,41.7 37.8,42.5 38.6,42.5 40.4,40.2 41.2,40.2 40.4,41 41.2,41 40.4,41.8 41.2,41.8 40.4,42.6 41.2,42.6 37.8,43.7 38.6,43.7 39.4,43.7 40.2,43.7 37.8,44.6 38.6,44.6 39.4,44.6 40.2,44.6 45.4,27.7 46.5,28.6 45.7,29.5 45.5,30.3 41.1,43.7 41.1,44.6 45.4,26.9 46.1,27.7 46.1,26.9 46.2,30.3 46.4,29.5
  pour Top (rank 2): 0,50 0,0 50,0 50,50
  pour Top (no thermals): 37.2,39.1 41.8,39.1 41.8,43.4
  pour Route2 (rank 2): 0,50 0,0 50,0 50,50
  pour Top (no thermals): 0,37 9.6,37 14.8,42.2 17.5,42.2 17.5,50 0,50
  pour Route2 (no thermals): 0,37 8.8,37 14,42.2 17.5,42.2 17.5,50 0,50
  pour Route15 (no thermals): 0,37 8.8,37 14,42.2 17.5,42.2 17.5,50 0,50
  pour Route15 (rank 2): 0,50 0,0 50,0 50,50
  pour Bottom (rank 2): 0,50 0,0 50,0 50,50
  pour Bottom (no thermals): 0,36.9 8.6,36.9 13.9,42.2 17.5,42.2 17.5,50 0,50
  pour Route15 (no thermals): 20,50 20,45 38,45 38,50
  pour Bottom (no thermals): 20,50 20,45 38,45 38,50
  pour Top (no thermals): 37,39.1 42,39.1 42,44 37,44
  pour Top (no thermals): 42,26 46.5,26 46.5,31 42,31
  pour Route2 (no thermals): 20,50 20,45 38,45 38,50
  pour Top (no thermals): 20,50 20,45 38,45 38,50
GNDIO  (via drill 0.35)
  Top 0.152: J2.1 46.57,15.97 42.9,15.97 C24.- | C16.2 39.76,13.1 v37.86,15 | U8.2 U8.2@1 | U8.2@1 v37.85,15 | v37.85,15 v37.86,15 | C24.- 41.06,17.81 C21.1 40.67,18.39 40.67,18.41 40.53,18.54 39.46,18.54 38.25,19.75 C37.2 | C24.- 41.13,15 37.95,15 | 37.95,15 v37.86,15 | U8.2@1 37.8,15.09 v37.85,15 | v37.85,15 37.95,14.94 37.95,15
  Bottom 0.152: U3.5 30.75,21.41 30.13,20.79 30.13,19.68 30.27,19.55 32.77,19.55 33.45,18.86 U2.2 36.38,18.86 37.47,17.78 38.47,17.78 U2.8 39.88,16.37 C24.-
ISENSEA
  Top 0.152: R38.1 28.9,21.66 C38.1 29.17,21.39 29.17,15.71 U1.17 U1.18
ISENSEB
  Top 0.152: R37.1 29.94,23.24 C39.1 29.74,22.6 29.74,16.67 30.07,16.34 30.07,15.65 U1.15 30.21,15.75 30.21,16.32 30.34,16.46 30.84,16.46 30.97,16.32 30.97,15.75 U1.13
LED_CAN  (via drill 0.35)
  Top 0.152: U1.40 27.21,7.25 27.21,7.82 27.59,8.21 v28.19,8.21
  Route2 0.152: R4.1 45.2,12.6 42.06,9.46 42.06,8.84 41.51,8.28 30.76,8.28 30.36,8.67 29.8,8.67 29.34,8.21 v28.19,8.21
  other vias: 45.2,13
LED_GREEN  (via drill 0.3)
  Top 0.152: v16.31,16.61 11.73,16.61 10.67,15.54 5.79,15.54 R7.1 | v23.77,18.14 23.77,16.92 23.01,16.15 23.01,15.24 24.08,14.17 U1.25
  Route2 0.152: v16.31,16.61 17.22,16.61 18.9,18.29 23.62,18.29 v23.77,18.14
LED_RED  (via drill 0.3)
  Top 0.152: v17.22,14.94 16.76,15.39 11.43,15.39 9.3,13.26 5.79,13.26 R9.1 | v20.42,14.78 21.34,14.78 23.01,13.11 24.08,13.11 U1.27
  Route2 0.152: v17.22,14.94 20.27,14.94 v20.42,14.78
LED_YELLOW  (via drill 0.3)
  Top 0.152: v15.39,16 11.58,16 9.91,14.33 5.79,14.33 R8.1 | v23.01,13.87 23.32,13.56 24.08,13.56 U1.26
  Route2 0.152: v15.39,16 18.75,12.65 21.79,12.65 v23.01,13.87
N$1
  Top 0.152: C17.1 R29.2
N$2
  Top 0.152: C18.1 36.24,31 R30.2
N$3
  Top 0.152: U6.16 17.73,22.82 20.7,25.8 R27.2
N$4  (via drill 0.35)
  Top 0.152: 19.3,23.2 18.42,22.32 18.42,21.52 U6.15 18.38,20.93 18.13,20.93 18,20.8 17.45,20.8 C4.1 | 19.3,23.2 20.6,24.5 R5.2 | v19,23.25 19.05,23.2 19.3,23.2
  Bottom 0.152: D2.C v19,23.25
N$5
  Top 0.152: C4.2 16.5,17.17 16.84,16.83 16.84,16.61 U6.1
N$6
  Top 0.152: R17.2 28.5,24.7 27.76,23.96 20.51,23.96 19.07,22.52 19.07,21.52 U6.14
N$7  (via drill 0.35)
  Top 0.152: v21.48,23.33 21.33,23.33 20.98,22.98 U6.11 | R20.2 38.67,32.67 v38.7,32.8
  Route15 0.152: v21.48,23.33 22.57,24.43 40.22,24.43 41.9,26.1 41.9,30.4 39.49,32.8 v38.7,32.8
N$8  (via drill 0.35)
  Top 0.152: U6.9 22.27,21.55 v22.76,22.04
  Route2 0.152: R28.2 20.92,33.3 20.26,32.64 20.26,25.54 22.76,23.04 v22.76,22.04
  other vias: 21.5,33.3
N$9
  Top 0.152: U6.8 22.27,16.12 23.02,16.88 23.02,18.77 C3.2
N$10  (via drill 0.35)
  Top 0.152: v21.53,22.35 21.53,21.57 U6.10 21.67,21.43 21.67,21.13 22,20.8 22.55,20.8 23,21.25 C3.1
  Route15 0.152: v21.53,22.35 21.53,22.49 20.92,23.1 20.92,23.56 22.16,24.8 39.89,24.8 41.59,26.5 41.59,30.27 39.62,32.24 38.47,32.24 37.81,32.9 R3.2
  Bottom 0.152: v21.53,22.35 D1.C
  other vias: 37.6,32.9
N$11
  Top 0.152: R7.2 3.45,15.4 LED1.A
N$12
  Top 0.152: R8.2 LED2.A
N$13
  Top 0.152: LED3.A 4.6,13.3 R9.2
N$14
  Top 0.152: LED4.A R4.2
N$15
  Bottom 0.152: U3.7 31.43,18.68 32.03,18.68 33.12,17.59 U2.1
N$16
  Bottom 0.152: U2.4 33.08,21.41 31.81,20.14 U3.6
N$18
  Top 0.152: R14.2 21.26,31.1 C14.1
N$19
  Top 0.152: U12.3 34.16,12.1 33.19,11.13 U1.6
N$20
  Top 0.152: C13.1 R13.2
N$22
  Top 0.152: R1.6 39.5,37.82 40.69,39.01 43.21,39.01 43.54,38.68 43.54,38.04 U11.3
N$23
  Top 0.152: U11.7 43,32.8 41.53,31.33 41.53,29.5 40.59,28.57 39.23,28.57 R2.5
N$25  (via drill 0.35)
  Top 0.152: R16.1 20,12.2 v20,13.5
  Bottom 0.152: v20,13.5 19.34,14.16 16.14,14.16 13.27,17.04 U4.1
N$26
  Top 0.152: U10.2 18.32,2.56 D3.C 20.93,3.25 L1.P$1
N$27
  Top 0.152: U10.3 18.5,3.83 18.9,4.24 C6.2
N$28
  Top 0.152: U10.5 11.6,5.7 R19.1 R18.1
N$29
  Top 0.152: R2.6 44.17,28.57 42.8,28.57 41.87,29.5 41.87,31.2 43.5,32.82 U11.8
N$30
  Top 0.152: U10.8 U10.7 | U10.8 U10.1 | R11.2 11.42,1.48 U10.8
N$31
  Top 0.152: R1.5 39.67,41.23 39.67,39.8 40.06,39.41 43.31,39.41 44.04,38.68 44.04,38.04 U11.2
N$34
  Top 0.152: U12.1 34.2,9.7 33.27,10.63 U1.5
OPOUTA  (via drill 0.35)
  Top 0.152: v43.3,31.68 43.3,32.1 44,32.8 U11.9
  Route2 0.152: R38.2 30.36,22.24 38.23,22.24 41.9,25.91 41.9,31.09 42.5,31.68 v43.3,31.68
  other vias: 28.9,23.7
OPOUTB  (via drill 0.35)
  Top 0.152: v44.5,36.7 U11.1 | R37.2 31.7,23.93 v31.8,23.8
  Route2 0.152: v31.8,23.8 33,22.6 37.8,22.6 41.5,26.3 41.5,31.3 44.5,34.3 v44.5,36.7
OUT+  (via drill 0.35)
  Top 0.152: C13.2 v21.6,32.4
  Route15 0.152: v21.6,32.4 22.2,33 29.5,33 v29.7,32.8
  other vias: 36.5,37.1 29.7,36 29.7,36.9 29.7,37.7 29.7,38.5 22.3,38.3 22.3,37.6 22.3,36.8 22.3,35.9 21.4,35.9 21.4,36.8 21.4,37.6 21.4,38.4 29.7,33.6 29.7,34.4 29.7,35.2 30.6,36 30.6,36.9 30.6,37.7 30.6,38.5 30.6,32.8 30.6,33.6 30.6,34.4 30.6,35.2 31.5,36 31.5,36.9 31.5,37.7 31.5,38.5 31.5,32.8 31.5,33.6 31.5,34.4 31.5,35.2 32.4,36 32.4,36.9 32.4,37.7 32.4,38.5 32.4,32.8 32.4,33.6 32.4,34.4 32.4,35.2 33.3,35.8 33.3,36.7 33.3,37.5 33.3,38.3 33.3,32.8 33.3,33.5 33.3,34.2 33.3,35 34.2,35.8 34.2,36.7 34.2,37.5 34.6,38.2 34.2,32.7 34.2,33.4 34.2,34.2 34.2,35 35,35.8 35,36.7 35,37.5 35.5,38.2 36.5,36.3 35,33.4 35,34.2 35,35 35.9,35.8 35.9,36.7 35.9,37.5 36.4,38.1 36.5,33 35.9,33.4 35.9,34.2 35.9,35 36.6,35.4 36.6,34.6 36.6,33.8
  pour Top (no thermals): 29.3,38.8 29.3,32.6 36.9,32.6 36.9,38.8
  pour Route15 (no thermals): 21,38.8 21,35 22.7,35 22.7,32.6 36.9,32.6 36.9,38.8
  pour Bottom (no thermals): 21,38.8 21,35 22.7,35 22.7,32.6 36.9,32.6 36.9,38.8
  pour Bottom (no thermals): 29.3,38.8 36.9,38.8 36.9,41 34.4,43.5 30.5,43.5 29.3,42.3
  pour Route15 (no thermals): 29.3,38.8 36.9,38.8 36.9,41 34.4,43.5 30.5,43.5 29.3,42.3
  pour Route2 (no thermals): 29.3,38.8 29.3,32.6 36.9,32.6 36.9,38.8
OUT-  (via drill 0.35)
  other vias: 21.3,30.2 21.3,29.4 21.3,28.6 21.3,27.8 21.8,27.3 22.2,30.2 22.2,29.4 22.2,28.6 22.3,27.9 23.1,27 23.1,30.2 23.1,29.4 23.1,28.6 23.1,27.8 24,27 24,30.2 24,29.4 24,28.6 24,27.8 24.9,27 24.9,30.2 24.9,29.4 24.9,28.6 24.9,27.8 25.8,27 25.9,30.2 25.9,29.4 25.9,28.6 25.9,27.8 26.8,27 26.8,30.2 26.8,29.4 26.8,28.6 26.8,27.8 27.7,27 27.7,30.2 27.7,29.4 27.7,28.6 27.7,27.8 28.6,27 28.6,30.2 28.6,29.4 28.6,28.6 28.6,27.8 29.5,27 29.5,30.2 29.5,29.4 29.5,28.6 29.5,27.8 30.3,27 30.3,30.2 30.3,29.4 30.3,28.6 30.3,27.8 31.1,27 31.1,30.2 31.1,29.4 31.1,28.6 31.1,27.8 31.9,27 31.9,30.2 31.9,29.4 31.9,28.6 31.9,27.8 32.8,27 32.8,30.2 32.8,29.4 32.8,28.6 32.8,27.8 33.7,27 33.7,30.2 33.7,29.4 33.7,28.6 33.7,27.8 34.6,27 34.7,30.2 34.7,29.4 34.7,28.6 34.7,27.8 35.6,27 35.6,30.2 35.6,29.4 35.6,28.6 35.6,27.8 36.3,27 36.3,30.2 36.3,29.4 36.3,28.6 36.3,27.8 24.9,26.2 24,26.2 23.1,26.2 30.2,26.2 31.1,26.2 31.9,26.2 32.8,26.2 29.5,26.2 33.7,26.2 34.6,26.2 35.6,26.2 36.3,26.2 25.8,26.2 26.7,26.2 27.7,26.2 28.6,26.2
  pour Top (no thermals): 21,32.2 21,27 22.7,27 22.7,25.1 36.9,25.1 36.9,32.2
  pour Route2 (no thermals): 21,32.2 21,27 22.7,27 22.7,25.1 36.9,25.1 36.9,32.2
  pour Route15 (no thermals): 21,32.2 21,27 22.7,27 22.7,25.1 36.9,25.1 36.9,32.2
  pour Bottom (no thermals): 21,32.2 21,27 22.7,27 22.7,25.1 36.8,25.1 36.8,32.2
  pour Route2 (no thermals): 28.9,32.2 28.9,40.8 26.3,43.4 26.2,43.5 24.3,43.5 21,40.2 21,32.2
  pour Top (no thermals): 28.9,32.2 28.9,40.8 26.2,43.5 24.3,43.5 21,40.2 21,32.2
SWCLK
  Top 0.152: U1.37 24.86,7.13 24.86,7.14 23.14,7.14 22.99,6.99 20.57,6.99 JP1.3
SWDIO
  Top 0.152: U1.34 22.73,9.63 21.57,10.79 17.73,10.79 JP1.2
TEMP  (via drill 0.35)
  Top 0.152: U1.11 33.47,13.63 33.84,14 33.84,17.09 35.98,19.23 R10.2 35.98,23.07 | 35.98,23.07 C15.2 | v35.94,23.28 35.98,23.24 35.98,23.07
  Route2 0.152: RT1.1 36.65,32.41 37.06,32 37.06,24.4 v35.94,23.28
  other vias: 35.31,32.41
USB_DM  (via drill 0.35)
  Top 0.152: U1.32 v23.16,10.63
  Bottom 0.152: v23.16,10.63 23.16,11.23 21.82,12.57 12.3,12.57 D8.4 11.8,12.77 10.84,13.74 8.29,13.74 7.99,14.04 J1.A7 8,14.04 8,13.97 8.19,13.79 8.19,13.29 8.05,13.16 7.51,13.16 J1.B7
USB_DP  (via drill 0.35)
  Top 0.152: U1.33 v25.02,10.13
  Bottom 0.152: J1.A6 7.36,13.56 6.82,13.56 6.58,13.79 6.58,14.29 6.82,14.52 7.36,14.52 J1.B6 8.09,14.54 8.48,14.14 11.26,14.14 11.8,14.69 D8.3 12.21,14.69 | v25.02,10.13 24.72,10.13 21.93,12.92 13.98,12.92 12.21,14.69 | R31.1 12.15,14.74 12.21,14.69
  other vias: 11.78,14.74
VBUS
  Bottom 0.152: J1.A4_B9 7.32,11.43 6.86,11.43 5.94,12.34 5.94,15.24 6.86,16.15 7.32,16.15 J1.B4_A9
VCC  (via drill 0.35)
  Top 0.152: C2.+ 1,23.84 1,13 6.08,7.92 R40.2 8.44,7.79 9.24,6.99 C7.2 9.24,4.36 R11.1 11.11,4.32 U10.6 | U7.3 12.04,21.2 12.08,21.24 C10.2 15.19,24.35 C12.1
  other vias: 16.4,27.1 16.4,30.3 16.4,29.5 16.4,28.7 16.4,27.9 17.3,27.1 17.3,30.3 17.3,29.5 17.3,28.7 17.3,27.9 18.1,27.1 18.1,30.3 18.1,29.5 18.1,28.7 18.1,27.9 18.9,27.1 18.9,30.3 18.9,29.5 18.9,28.7 18.9,27.9 19.7,27.1 19.7,30.3 19.7,29.5 19.7,28.7 19.7,27.9 18,26.3 18.9,26.3 19.7,26.3 17.3,26.3 16.4,26.3 16.6,35 16.6,38.2 16.6,37.4 16.6,36.6 16.6,35.8 17.5,35 17.5,38.2 17.5,37.4 17.5,36.6 17.5,35.8 18.3,35 18.3,38.2 18.3,37.4 18.3,36.6 18.3,35.8 19.1,35 19.1,38.2 19.1,37.4 19.1,36.6 19.1,35.8 19.9,35 19.9,38.2 19.9,37.4 19.9,36.6 19.9,35.8 18.2,34.2 19.1,34.2 19.9,34.2 17.5,34.2 16.6,34.2 15.7,35 15.8,38.2 15.8,37.4 15.8,36.6 15.8,35.8 15.7,34.2 15.5,27.1 15.6,30.3 15.6,29.5 15.6,28.7 15.6,27.9 15.5,26.3
  pour Top (no thermals): 3,36.6 9.7,36.6 14.9,41.8 17.2,41.8 20.2,38.8 20.2,23.4 3,23.4
  pour Route2 (no thermals): 3,36.59 8.8,36.5 14.3,41.8 17.2,41.8 20.2,38.8 20.2,23.4 3,23.4
  pour Route15 (no thermals): 3,36.59 8.8,36.5 14.3,41.8 17.2,41.8 20.2,38.8 20.2,23.4 3,23.4
  pour Bottom (no thermals): 3,36.5 8.8,36.5 14.1,41.8 17.2,41.8 20.3,38.7 20.3,23.4 3,23.4
VCSA  (via drill 0.3, 0.35)
  Top 0.152: R1.4 37.5,37 37.5,38.5 37,39 C17.2 | v39.59,38.76 39.59,38.7
  Bottom 0.152: v39.59,38.76 39.59,38.7
  other vias: 40.5,35 37.6,35 38.5,35 40.5,35.8 37.6,35.8 38.5,35.8 40.5,36.6 37.6,36.6 38.5,36.6 40.5,37.4 37.6,37.4 38.5,37.4 40.6,38.1 37.6,38.3 38.5,38.3 41.3,35.8 41.3,36.6 41.3,37.4 41.4,38.2 41.3,35
  pour Top (no thermals): 37.3,34.4 41.8,34.4 41.8,38.7 37.3,38.7
  pour Route2 (no thermals): 37.3,34.5 41.8,34.5 41.8,38.7 37.3,38.7
  pour Route15 (no thermals): 37.3,34.5 41.8,34.5 41.8,38.7 37.3,38.7
  pour Bottom (no thermals): 37.3,34.5 41.8,34.5 41.8,38.7 37.3,38.7
VCSB  (via drill 0.3, 0.35)
  Top 0.152: R2.1 37.7,31.5 C18.2 | 38.52,30.84 v38.52,31.14
  Bottom 0.152: v38.52,31.14 38.52,30.84
  other vias: 37.7,27.6 37.7,30.4 37.7,29.6 38.5,27.6 38.4,30.3 38.5,29.6 39.3,27.5 39.2,30.3 39.3,29.6 40.1,27.6 39.9,30.3 40,29.6 40.9,27.6 40.6,30.4 40.7,29.7 38.5,26.9 39.3,26.8 40.1,26.8 40.9,26.8 37.7,26.9
  pour Top (no thermals): 41.5,26.5 41.5,30.9 37.3,30.9 37.3,26.5
  pour Route15 (no thermals): 41.5,26.5 41.5,30.9 37.3,30.9 37.3,26.5
  pour Bottom (no thermals): 41.5,26.5 41.5,30.9 37.3,30.9 37.3,26.5
  pour Route2: 37.3,26.5 41.5,26.5 41.5,30.9 37.3,30.9
VSENSE  (via drill 0.35)
  Top 0.152: R40.1 9.49,7.97 C30.2 11.43,7.97 R39.2 | v31.66,13.13 U1.10
  Route15 0.152: R39.2 11.84,7.94 12.83,6.95 26.15,6.95 31.66,12.46 v31.66,13.13
  other vias: 11.46,7.94

### Text on the board
tNames: +-注意!